# Altium schematic sheet QG-2864KSWEG01_OLED_Display_Module.SchDoc: QG-2864KSWEG01 Display Module
size A4
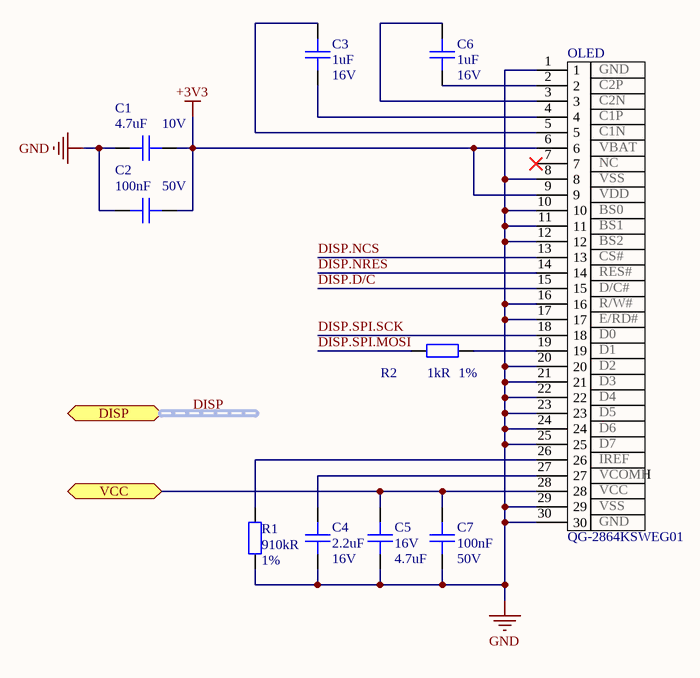
[diagram p0: QG-2864KSWEG01_OLED_Display_Module.SchDoc]

## Parts
C1  Voltage Rating: 10V  Capacitance: 4.7uF  [C0603]  (hidden comment: CAP CER 4.7UF 10V X5R 0603)
C2  Capacitance: 100nF  Voltage: 50V  [C0402]  (hidden comment: CAP CER 0.1UF 50V X7R 0402)
C3  Capacitance: 1uF  Voltage Rating: 16V  [C0603]  (hidden comment: CAP CER 1UF 16V X5R 0603)
C4  Capacitance: 2.2uF  Voltage Rating: 16V  [C0603]  (hidden comment: CAP CER 2.2UF 16V X5R 0603)
C5  Voltage Rating: 16V  Capacitance: 4.7uF  [C0603]  (hidden comment: CAP CER 4.7UF 16V X5R 0603)
C6  Capacitance: 1uF  Voltage Rating: 16V  [C0603]  (hidden comment: CAP CER 1UF 16V X5R 0603)
C7  Capacitance: 100nF  Voltage: 50V  [C0402]  (hidden comment: CAP CER 0.1UF 50V X7R 0402)
OLED  QG-2864KSWEG01  pin_1: GND  pin_2: C2P  pin_3: C2N  pin_4: C1P  pin_5: C1N  pin_6: VBAT  pin_7: NC  pin_8: VSS  pin_9: VDD  pin_10: BS0  pin_11: BS1  pin_12: BS2  pin_13: CS#  pin_14: RES#  pin_15: D/C#  pin_16: R/W#  pin_17: E/RD#  pin_18: D0  pin_19: D1  pin_20: D2  pin_21: D3  pin_22: D4  pin_23: D5  pin_24: D6  pin_25: D7  pin_26: IREF  pin_27: VCOMH  pin_28: VCC  [QG-2864KSWEG01_Flipped]
R1  Resistance: 910kR  Tolerance: 1%  [R0402]  (hidden comment: RES SMD 910K OHM 1% 1/16W 0402)
R2  Tolerance: 1%  Resistance: 1kR  [R0402]  (hidden comment: RES SMD 1K OHM 1% 1/16W 0402)

## Ports
DISP (harness DISP_SPI), VCC

## Nets
+3V3: C1.1 C2.1 OLED.6 OLED.9
GND: C1.2 C2.2 C4.1 C5.2 C7.2 OLED.1 OLED.8 OLED.10 OLED.11 OLED.12 OLED.16 OLED.17 OLED.20 OLED.21 OLED.22 OLED.23 OLED.24 OLED.25 OLED.29 OLED.30 R1.2
DISP.D/C: OLED.15
DISP.NCS: OLED.13
DISP.NRES: OLED.14
DISP.SPI.MOSI: R2.1
DISP.SPI.SCK: OLED.18
VCC: C5.1 C7.1 OLED.28 ; port VCC
NetC3_1: C3.1 OLED.4
NetC3_2: C3.2 OLED.5
NetC4_2: C4.2 OLED.27
NetC6_1: C6.1 OLED.2
NetC6_2: C6.2 OLED.3
NetOLED_19: OLED.19 R2.2
NetOLED_26: OLED.26 R1.1

Not connected (* = marked no-connect by the designer): OLED 7*

## Buses and harness runs
harness DISP = port DISP

## Notes on the sheet
- Title
- Size:
- Date:
- A4
- Number:
- Time:
- Revision:
- Sheet
- of
- File:

## Library data of the parts
C1 = CAP CER 4.7UF 10V X5R 0603: 4.7µF ±10% 10V Ceramic Capacitor X5R 0603 (1608 Metric); Manufacturer: Yageo; Manufacturer Part Number: CC0603KRX5R6BB475; Supplier 1: Digi-Key; Stock 1: 325858; Pricing 1: 1=0.26, 10=0.18, 100=0.102, 500=0.072, 1000=0.063 (USD); Mount: Surface Mount; Case Code (Imperial): 0603; Case Code (Metric): 1608; Min Operating Temperature: -55°C; Max Operating Temperature: 85°C; Voltage Rating (DC): 10V; Tolerance: 10%; Packaging: Tape and Reel; Package Quantity: 1; Dielectric: X5R; Termination: SMD/SMT; Composition: Ceramic; Length: 1.6mm; Height: 0.8mm; Width: 0.8mm; Thickness: 0.035inch; Depth: 0.8mm; Radiation Hardening: No; REACH SVHC: Unknown; Lead Free: Lead Free; Halogen Free: Halogen Free; ComponentLink1URL: http://www.farnell.com/datasheets/2167237.pdf?src-supplier=Element14; ComponentLink1Description: http://www.farnell.com/datasheets/2167237.pdf?src-supplier=Element14; ComponentLink2URL: http://www.yageo.com/documents/recent/UPY-GPHC_X5R_4V-to-50V_25.pdf?src-supplier=Digi-Key; ComponentLink2Description: http://www.yageo.com/documents/recent/UPY-GPHC_X5R_4V-to-50V_25.pdf?src-supplier=Digi-Key; ComponentLink3URL: http://www.yageo.com/documents/recent/UPY-GPHC_X5R_4V-to-50V_12.pdf?src-supplier=Avnet; ComponentLink3Description: http://www.yageo.com/documents/recent/UPY-GPHC_X5R_4V-to-50V_12.pdf?src-supplier=Avnet; ComponentLink4URL: http://www.yageo.com/documents/recent/UPY-GPHC_X5R_4V-to-50V_12.pdf?src-supplier=Avnet+Europe; ComponentLink4Description: http://www.yageo.com/documents/recent/UPY-GPHC_X5R_4V-to-50V_12.pdf?src-supplier=Avnet+Europe; Supplier Part Number 1: 311-1455-1-ND; Case/Package: 0603
C2 C7 = CAP CER 0.1UF 50V X7R 0402: 0.1µF ±10% 50V Ceramic Capacitor X7R 0402 (1005 Metric); Manufacturer Part Number: CGA2B3X7R1H104K050BB; Manufacturer: TDK; Supplier 1: Digi-Key; Stock 1: 2925303; Pricing 1: 1=0.17, 10=0.118, 50=0.0668, 100=0.0553, 500=0.0388, 1000=0.0321, 2500=0.0299, 5000=0.0273 (USD); Mount: Surface Mount; Case Code (Metric): 1005; Case Code (Imperial): 0402; Min Operating Temperature: -55°C; Max Operating Temperature: 125°C; Tolerance: 10%; Dielectric: X7R; Voltage Rating: 50V; Voltage Rating (DC): 50V; Packaging: Tape and Reel; Package Quantity: 1; Termination: SMD/SMT; Composition: Ceramic; Length: 1mm; Height: 0.5mm; Width: 0.02inch; Thickness: 0.022inch; Depth: 0.5mm; REACH SVHC: No SVHC; Lead Free: Lead Free; ComponentLink1URL: http://product.tdk.com/capacitor/mlcc/en/documents/mlccspec_automotive_general_midvoltage_en.pdf?src-supplier=Future+Electronics; ComponentLink1Description: http://product.tdk.com/capacitor/mlcc/en/documents/mlccspec_automotive_general_midvoltage_en.pdf?src-supplier=Future+Electronics; ComponentLink2URL: http://www.farnell.com/datasheets/1807242.pdf?src-supplier=Element14; ComponentLink2Description: http://www.farnell.com/datasheets/1807242.pdf?src-supplier=Element14; ComponentLink3URL: http://www.mouser.com/ds/2/400/lcc_automotive_general_en-843974.pdf?src-supplier=Mouser; ComponentLink3Description: http://www.mouser.com/ds/2/400/lcc_automotive_general_en-843974.pdf?src-supplier=Mouser; ComponentLink4URL: http://www.farnell.com/datasheets/1936565.pdf?src-supplier=Element14; ComponentLink4Description: http://www.farnell.com/datasheets/1936565.pdf?src-supplier=Element14; ComponentLink5URL: http://www.farnell.com/datasheets/1735392.pdf?src-supplier=Element14; ComponentLink5Description: http://www.farnell.com/datasheets/1735392.pdf?src-supplier=Element14; Supplier Part Number 1: 445-6899-1-ND; Case/Package: 0402; Weight: 2.3E-05oz; Ratings: AEC-Q200
C3 C6 = CAP CER 1UF 16V X5R 0603: 1µF ±10% 16V Ceramic Capacitor X5R 0603 (1608 Metric); Manuf_Part_1: CC0603KRX5R7BB105; Manuf_1: YAGEO; Dissipation Factor: 7%; Revision: July-2002: Re-released for DXP Platform.; Order: CC0603KRX5R7BB105; Supplier 1: Digi-Key; Manufacturer: Yageo; Manufacturer Part Number: CC0603KRX5R7BB105; Stock 1: 2299176; Pricing 1: 1=0.11, 10=0.081, 100=0.0382, 500=0.0268, 1000=0.0222 (USD); Mount: Surface Mount; Number of Pins: 2; Case Code (Imperial): 0603; Case Code (Metric): 1608; Min Operating Temperature: -55°C; Max Operating Temperature: 85°C; Tolerance: 10%; Dielectric: X5R; Voltage Rating (DC): 16V; Packaging: Tape and Reel; Package Quantity: 4000; Termination: SMD/SMT; Composition: Ceramic; Length: 1.6mm; Height: 0.8mm; Width: 0.8mm; Thickness: 0.035inch; Depth: 0.8mm; Radiation Hardening: No; REACH SVHC: Unknown; Lead Free: Lead Free; Halogen Free: Halogen Free; ComponentLink1URL: https://www.verical.com/server-webapp/html/getDatasheet?partID=317657&src-supplier=Verical; ComponentLink1Description: https://www.verical.com/server-webapp/html/getDatasheet?partID=317657&src-supplier=Verical; ComponentLink2URL: http://www.yageo.com/documents/recent/UPY-GPHC_X5R_4V-to-50V_25.pdf?src-supplier=Digi-Key; ComponentLink2Description: http://www.yageo.com/documents/recent/UPY-GPHC_X5R_4V-to-50V_25.pdf?src-supplier=Digi-Key; ComponentLink3URL: http://www.farnell.com/datasheets/1525783.pdf?src-supplier=Element14; ComponentLink3Description: http://www.farnell.com/datasheets/1525783.pdf?src-supplier=Element14; ComponentLink4URL: http://www.farnell.com/datasheets/1359354.pdf?src-supplier=Element14; ComponentLink4Description: http://www.farnell.com/datasheets/1359354.pdf?src-supplier=Element14; ComponentLink5URL: http://www.yageo.com/documents/recent/UPY-GPHC_X5R_4V-to-50V_12.pdf?src-supplier=Avnet; ComponentLink5Description: http://www.yageo.com/documents/recent/UPY-GPHC_X5R_4V-to-50V_12.pdf?src-supplier=Avnet; Supplier Part Number 1: 311-1444-1-ND; Value: 1uF; Case/Package: 0603
C4 = CAP CER 2.2UF 16V X5R 0603: 2.2µF ±10% 16V Ceramic Capacitor X5R 0603 (1608 Metric); Manufacturer: Yageo; Manufacturer Part Number: CC0603KRX5R7BB225; Supplier 1: Digi-Key; Stock 1: 126369; Pricing 1: 1=0.19, 10=0.132, 100=0.0667, 500=0.0456, 1000=0.0404 (USD); Mount: Surface Mount; Case/Package: 0603; Case Code (Metric): 1608; Case Code (Imperial): 0603; Min Operating Temperature: -55°C; Max Operating Temperature: 85°C; Tolerance: 10%; Packaging: Tape and Reel; Dielectric: X5R; Termination: SMD/SMT; Voltage Rating (DC): 16V; Length: 1.6mm; Width: 0.031inch; Thickness: 0.035inch; Lead Free: Lead Free; ComponentLink1URL: http://www.farnell.com/datasheets/2167237.pdf?src-supplier=Element14; ComponentLink1Description: http://www.farnell.com/datasheets/2167237.pdf?src-supplier=Element14; Supplier Part Number 1: 311-1784-1-ND; Halogen Free: Halogen Free; Composition: Ceramic; Height: 0.8mm; Depth: 0.8mm; Radiation Hardening: No; REACH SVHC: Unknown
C5 = CAP CER 4.7UF 16V X5R 0603: 4.7µF ±10% 16V Ceramic Capacitor X5R 0603 (1608 Metric); Manufacturer: Yageo; Manufacturer Part Number: CC0603KRX5R7BB475; Supplier 1: Digi-Key; Stock 1: 332229; Pricing 1: 1=0.5, 10=0.355, 50=0.2688, 100=0.2341 (USD); Mount: Surface Mount; Case Code (Imperial): 0603; Case Code (Metric): 1608; Min Operating Temperature: -55°C; Max Operating Temperature: 85°C; Voltage Rating (DC): 16V; Tolerance: 10%; Packaging: Tape and Reel; Dielectric: X5R; Termination: SMD/SMT; Composition: Ceramic; Length: 1.6mm; Height: 0.8mm; Width: 0.8mm; Thickness: 0.037inch; Depth: 0.8mm; Lead Free: Lead Free; Halogen Free: Halogen Free; ComponentLink1URL: http://www.mouser.com/ds/2/447/UPY-GPHC_X5R_4V-to-50V_25-1131599.pdf?src-supplier=Mouser; ComponentLink1Description: http://www.mouser.com/ds/2/447/UPY-GPHC_X5R_4V-to-50V_25-1131599.pdf?src-supplier=Mouser; ComponentLink2URL: http://www.yageo.com/documents/recent/UPY-GPHC_X5R_4V-to-50V_25.pdf?src-supplier=Digi-Key; ComponentLink2Description: http://www.yageo.com/documents/recent/UPY-GPHC_X5R_4V-to-50V_25.pdf?src-supplier=Digi-Key; ComponentLink3URL: http://components.arrow.com/part/dataview/0323_04166500?src-supplier=Arrow+Europe; ComponentLink3Description: http://components.arrow.com/part/dataview/0323_04166500?src-supplier=Arrow+Europe; Supplier Part Number 1: 311-1785-1-ND; Case/Package: 0603; Weight: 7.1E-05oz
OLED = MOD QG-2864KSWEG01 OLED DISPLAY: OLED Display Module FPC #LT1306P22 TOP 30P 0.7MM; Manufacturer: Limito Technology Inc.; Number of Columns: 128; Number of Circuits: 30; Manufacturer Part Number: QG-2864KSWEG01; Mount: FPC Soldered on PCB; Min Operating Temperature: -40°C; Max Operating Temperature: 70°C; Number of Rows: 64; Number of Contacts: 30; Pitch: 0.7mm; pin_29: VSS; pin_30: GND
R1 = RES SMD 910K OHM 1% 1/16W 0402: 910 kOhms ±1% 0.063W, 1/16W Chip Resistor 0402 (1005 Metric) Moisture Resistant Thick Film; Manufacturer: Yageo; Manufacturer Part Number: RC0402FR-07910KL; Voltage Rating (DC): 50V; Power Rating: 62.5mW; Temperature Coefficient: 100ppm/°C; Max Power Dissipation: 63mW; Supplier 1: Digi-Key; Stock 1: 96210; Pricing 1: 1=0.1, 10=0.015, 100=0.0062, 1000=0.0028, 2500=0.0024, 5000=0.002 (USD); Case/Package: 0402; Case Code (Imperial): 0402; Case Code (Metric): 1005; Min Operating Temperature: -55°C; Max Operating Temperature: 155°C; Packaging: Tape and Reel; Voltage Rating: 50V; Termination: SMD/SMT; Composition: Thick Film; Number of Terminations: 2; Military Standard: Not; Features: Moisture Resistant; Length: 1mm; Height: 0.016inch; Depth: 0.5mm; Width: 0.5mm; Lead Free: Lead Free; REACH SVHC: Unknown; ComponentLink1URL: http://www.yageo.com/documents/recent/PYu-RC0402_51_RoHS_L_6.pdf?src-supplier=Avnet+Europe; ComponentLink1Description: http://www.yageo.com/documents/recent/PYu-RC0402_51_RoHS_L_6.pdf?src-supplier=Avnet+Europe; ComponentLink2URL: https://www.verical.com/server-webapp/html/getDatasheet?partID=741075&src-supplier=Verical; ComponentLink2Description: https://www.verical.com/server-webapp/html/getDatasheet?partID=741075&src-supplier=Verical; ComponentLink3URL: http://www.yageo.com/documents/recent/PYu-RC0402_51_RoHS_L_6.pdf?src-supplier=Avnet; ComponentLink3Description: http://www.yageo.com/documents/recent/PYu-RC0402_51_RoHS_L_6.pdf?src-supplier=Avnet; Supplier Part Number 1: YAG3257CT-ND; Contact Plating: Tin,Matte; Mount: Surface Mount
R2 = RES SMD 1K OHM 1% 1/16W 0402: 1 kOhms ±1% 0.063W, 1/16W Chip Resistor 0402 (1005 Metric) Moisture Resistant Thick Film; Manufacturer: Yageo; Manufacturer Part Number: RC0402FR-071KL; Temperature Coefficient: 100ppm/°C; Power Rating: 62.5mW; Voltage Rating: 50V; Supplier 1: Digi-Key; Stock 1: 9574509; Pricing 1: 1=0.1, 10=0.015, 100=0.0062, 1000=0.0028, 2500=0.0024, 5000=0.002 (USD); Case/Package: 0402; Number of Pins: 2; Case Code (Imperial): 0402; Case Code (Metric): 1005; Min Operating Temperature: -55°C; Max Operating Temperature: 155°C; Packaging: Tape and Reel; Composition: Thick Film; Voltage Rating (DC): 50V; Termination: SMD/SMT; Military Standard: Not; Length: 1mm; Height: 0.32mm; Width: 0.5mm; Depth: 0.5mm; REACH SVHC: Unknown; Lead Free: Lead Free; ComponentLink1URL: http://www.mouser.com/ds/2/447/PYu-RC0402_51_RoHS_L_6_r-8721.pdf?src-supplier=Mouser; ComponentLink1Description: http://www.mouser.com/ds/2/447/PYu-RC0402_51_RoHS_L_6_r-8721.pdf?src-supplier=Mouser; ComponentLink2URL: http://documents.rs-components.com/techlib://itc_doclist_GB.htm?stockno=6186122&src-supplier=RSComponents; ComponentLink2Description: http://documents.rs-components.com/techlib://itc_doclist_GB.htm?stockno=6186122&src-supplier=RSComponents; ComponentLink3URL: http://www.farnell.com/datasheets/1018594.pdf?src-supplier=Element14; ComponentLink3Description: http://www.farnell.com/datasheets/1018594.pdf?src-supplier=Element14; ComponentLink4URL: http://www.yageo.com/documents/recent/PYu-RC0402_51_RoHS_L_6_r.pdf?src-supplier=Future+Electronics; ComponentLink4Description: http://www.yageo.com/documents/recent/PYu-RC0402_51_RoHS_L_6_r.pdf?src-supplier=Future+Electronics; ComponentLink5URL: http://www.farnell.com/datasheets/2167052.pdf?src-supplier=Element14; ComponentLink5Description: http://www.farnell.com/datasheets/2167052.pdf?src-supplier=Element14; Supplier Part Number 1: 311-1.00KLRCT-ND; Mount: Surface Mount